# EAGLE design HexBusAdapter (EAGLE 7.7.0)
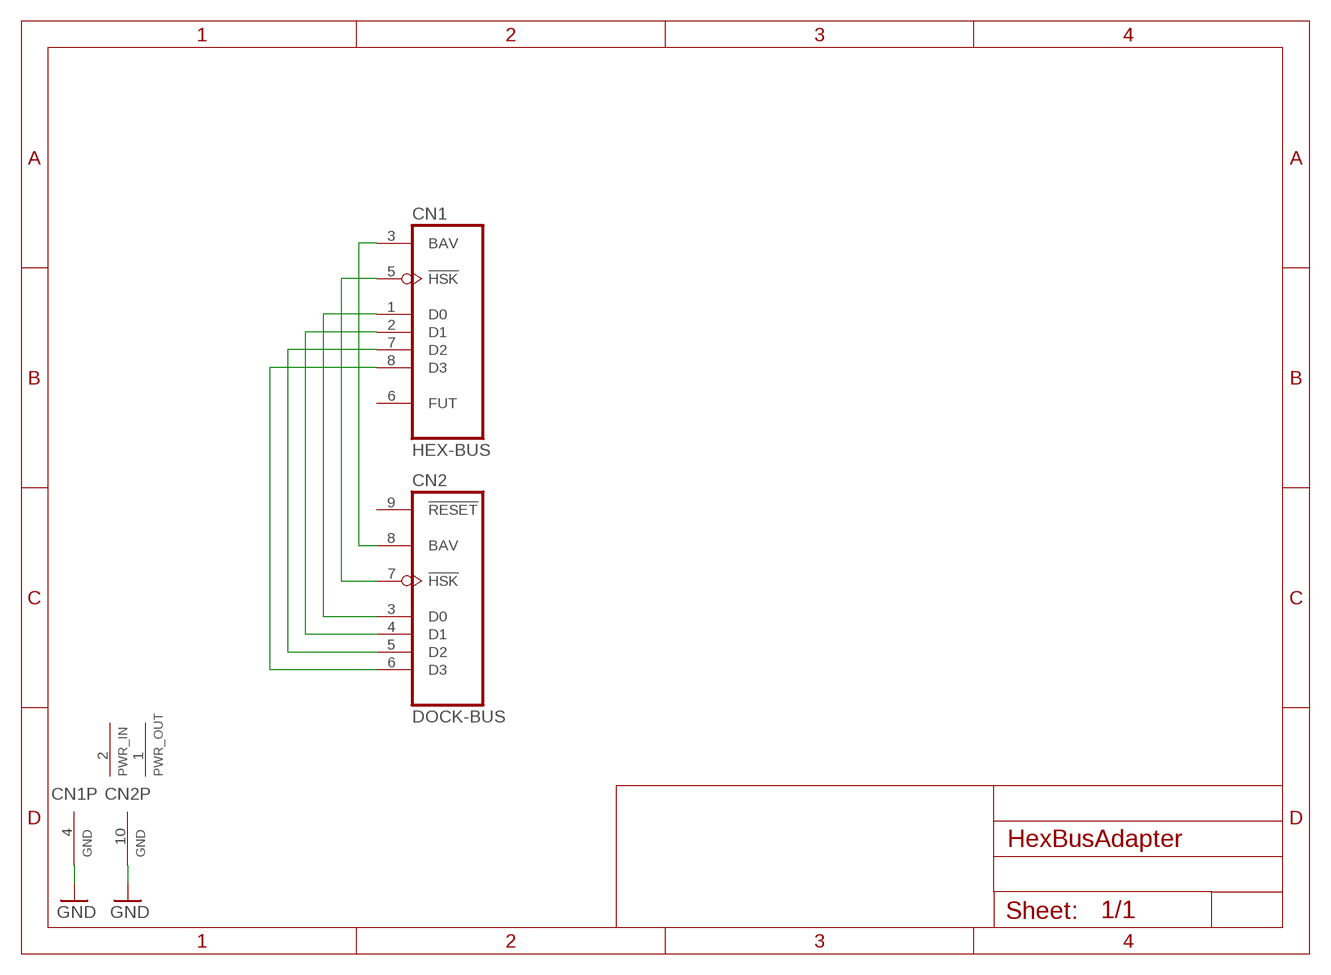
[diagram p0: schematic, sheet 1]

## Parts
CN1  HEX-BUS  [HEX-BUS]
CN2  DOCK-BUS  DOCK-BUSR  [DOCK-BUS-RP]

## Nets
!HSK: CN1.5(!HSK) CN2.7(!HSK)
BAV: CN1.3(BAV) CN2.8(BAV)
D0: CN1.1(D0) CN2.3(D0)
D1: CN1.2(D1) CN2.4(D1)
D2: CN1.7(D2) CN2.5(D2)
D3: CN1.8(D3) CN2.6(D3)
GND: CN1.4(GND) CN2.10(GND)
Unconnected: CN1.6(FUT) CN2.9(!RESET)

## Power pins joined to a net without a drawn wire
PWN_IN: CN2.2(PWN_IN)
PWR_OUT: CN2.1(PWR_OUT)

## Library data of the parts
CN1 = ti-cc40:HEX-BUS: TI HexBus Connector; OC_FARNELL: unknown; OC_NEWARK: unknown
CN2 = ti-cc40:DOCK-BUS

## Board
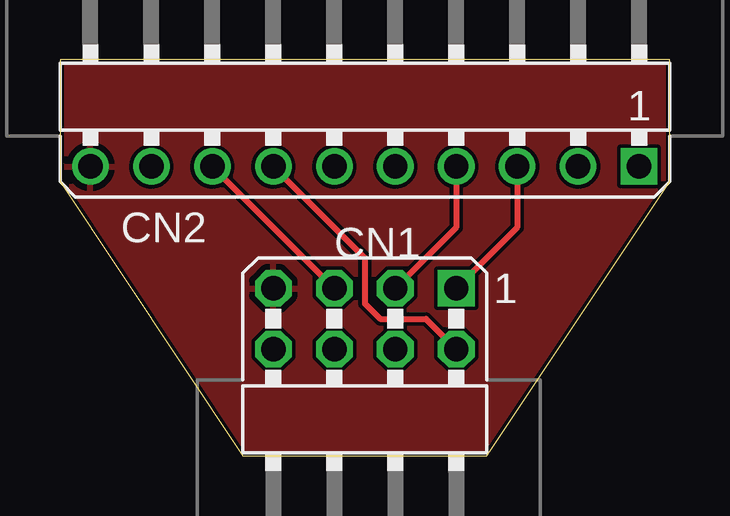
[diagram p1: board, top side]
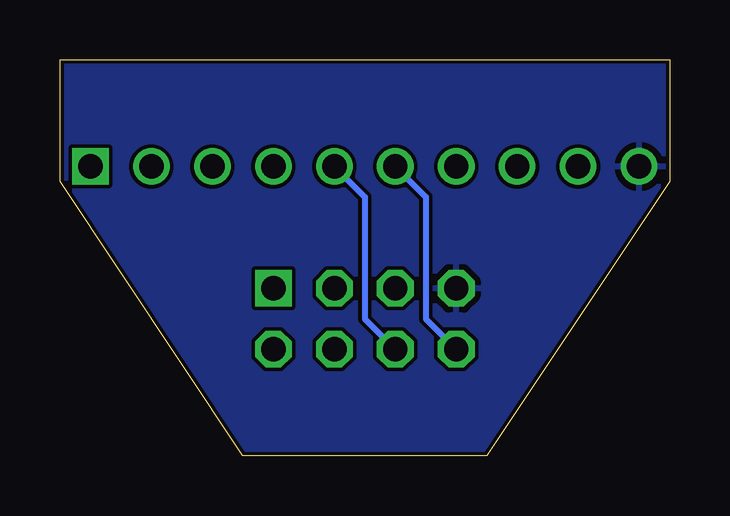
[diagram p2: board, bottom side, seen from below]

Size 25.4 x 16.51 mm. Coordinates in mm from the lower left corner, seen from the top.
Outline: 0,11.43 7.62,0 17.78,0 25.4,11.43 25.4,16.51 0,16.51 0,11.43
Copper layers (1*16): Top 0.035mm / dielectric 1.5mm / Bottom 0.035mm
Design rules "hackvana": minimum track width 6mil, minimum drill 0.3mm, track to track 6mil, track to pad 6mil, pad to pad 6mil, via to via 6mil, smd to smd 0mil, copper to edge 6mil, drill to drill 6mil, minimum pad ring 10mil, minimum via ring 6mil, stop-mask expansion 2mil, vias tented up to drill 100mil, thermal gap 10mil

### Footprints (pad centres in the part's own frame; a part is rotated, then mirrored left to right if it is on the bottom)
HEX-BUS = drill 1.016 square: 1 -3.81,-1.27 | drill 1.016 octagon: 2 -1.27,-1.27; 3 1.27,-1.27; 4 3.81,-1.27; 5 -3.81,1.27; 6 -1.27,1.27; 7 1.27,1.27; 8 3.81,1.27
DOCK-BUS-RP = drill 1.016 square: 1 11.43,0 | drill 1.016: 2 8.89,0; 3 6.35,0; 4 3.81,0; 5 1.27,0; 6 -1.27,0; 7 -3.81,0; 8 -6.35,0; 9 -8.89,0; 10 -11.43,0

### Placement (x,y rotation side)
CN1  12.7,5.71 180 top
CN2  12.7,12.07 0 top

### Tracks (layer width: path | path; a pad name or v marks a point on that pad's centre or on a via)
!HSK
  Top 0.254: CN2.7 12.7,8.26 12.7,6.35 13.33,5.71 15.24,5.71 CN1.5
BAV
  Top 0.254: CN2.8 CN1.3
D0
  Top 0.254: CN2.3 19.05,9.53 CN1.1
D1
  Top 0.254: CN2.4 16.51,9.53 CN1.2
D2
  Bottom 0.254: CN2.5 12.7,10.79 12.7,5.71 CN1.7
D3
  Bottom 0.254: CN2.6 10.16,10.79 10.16,5.71 CN1.8
GND
  pour Bottom: 0,16.51 25.4,16.51 25.4,11.43 17.78,0 7.62,0 0,11.43
  pour Top: 0,16.51 25.4,16.51 25.4,11.43 17.78,0 7.62,0 0,11.43